# EAGLE design oshcamp23-badge-RevA2 (EAGLE 9.6.2)

## Sheet 1 of 2
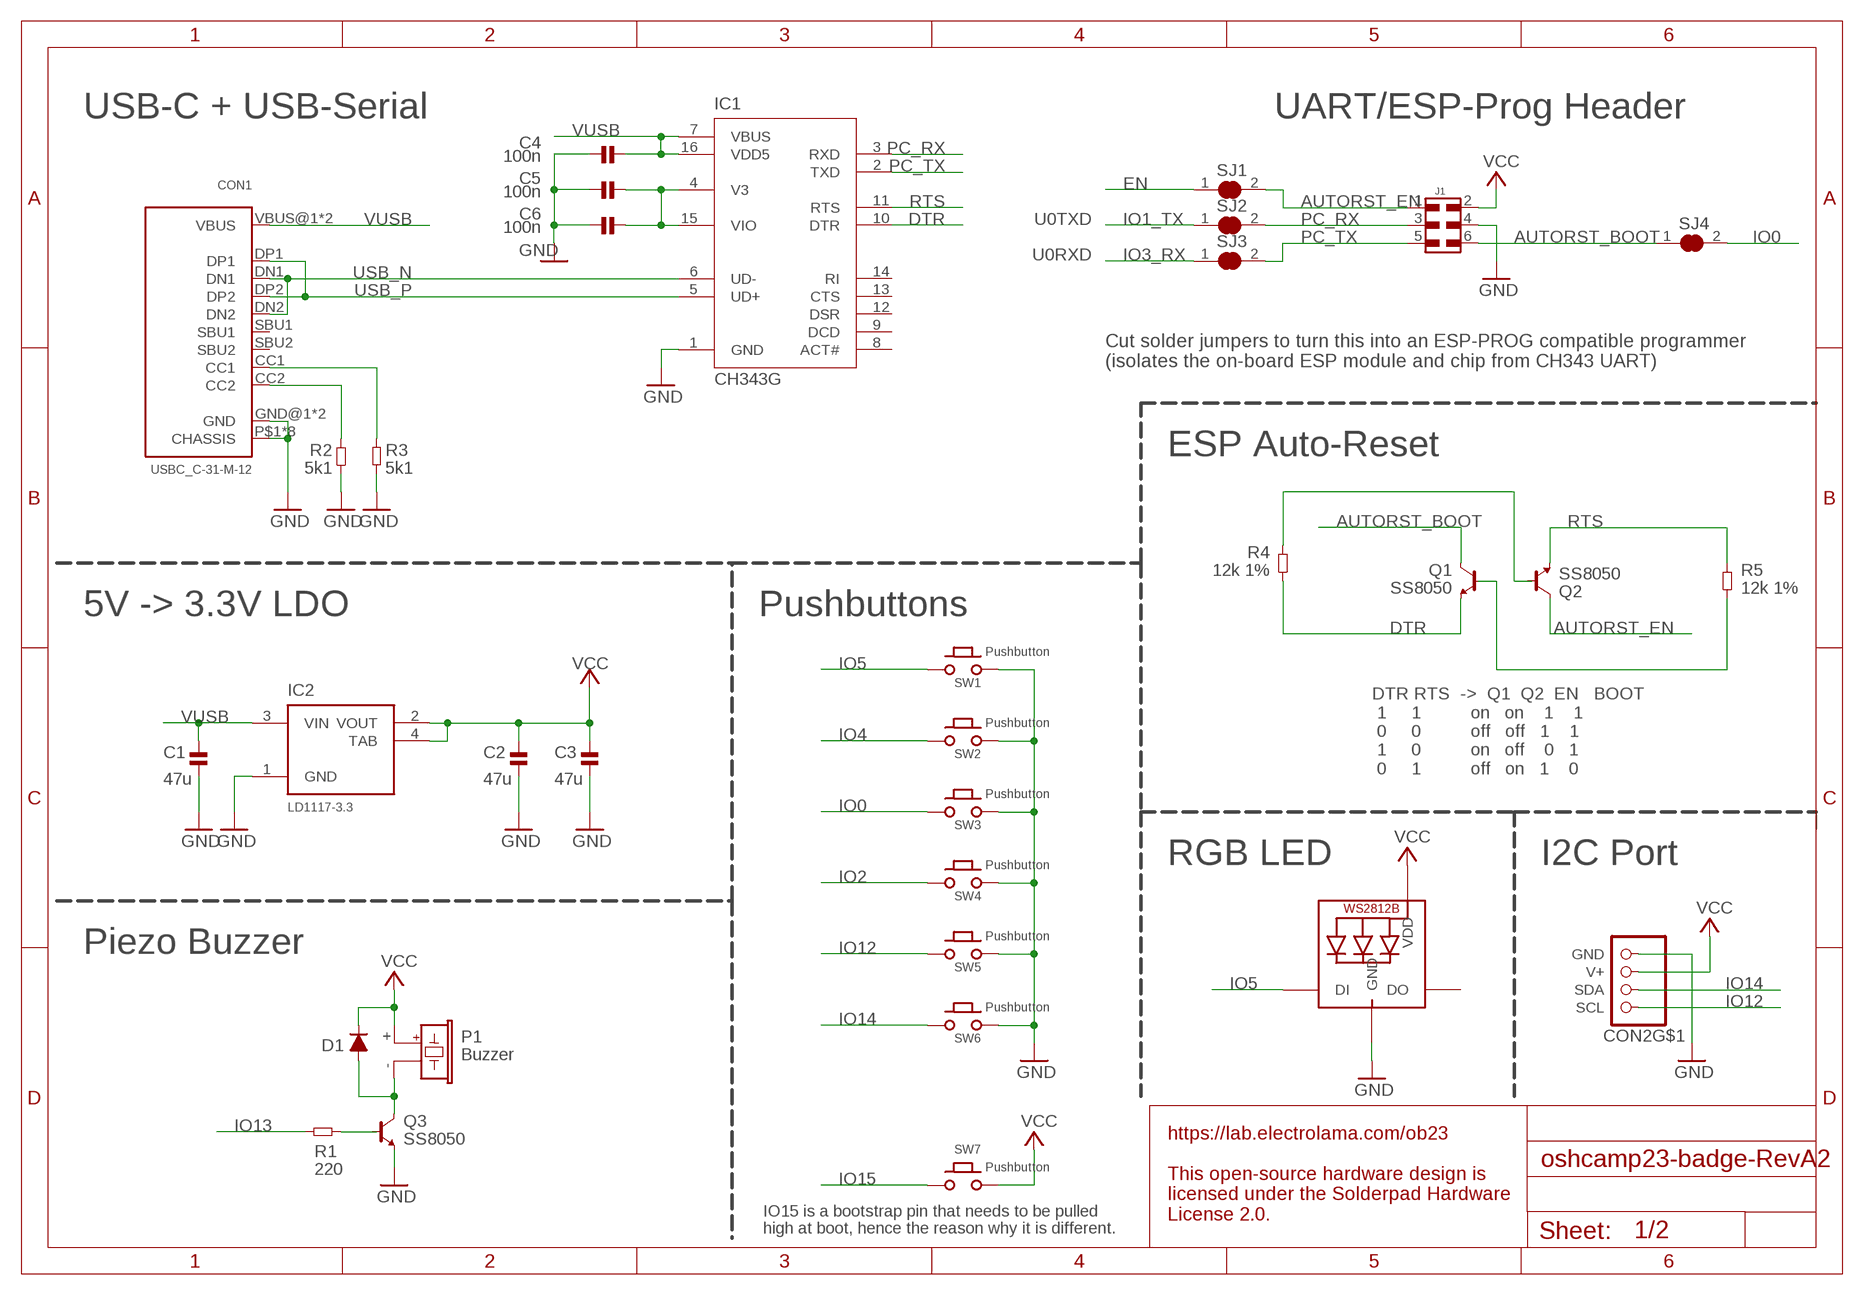
[diagram p0: schematic, sheet 1]

### Parts
C1  47u  CAP-1206  [_PKG_C_1206]
C2  47u  CAP-1206  [_PKG_C_1206]
C3  47u  CAP-1206  [_PKG_C_1206]
C4  100n  CAP-0402  [_PKG_C_0402]
C5  100n  CAP-0402  [_PKG_C_0402]
C6  100n  CAP-0402  [_PKG_C_0402]
CON1  USBC_C-31-M-12  USBC_USB-C-12  [USBC_C-31-M-12]
CON2  STEMMA_I2C_QT  [JST_SH4]
D1  DIODE-SWITCHING-1N4148W  [_PKG_SOD123]
IC1  CH343G  INTERFACE-CH343G  [_PKG_SOP16]
IC2  LD1117-3.3  POWER-LDO-LD1117-SOT223-4  [_PKG_SOT223-4_TI-DCY4]
J1  61030621121  6103XX21121_61030621121  [61030621121]
LED1  WS2812B5050  [WS2812B]
P1  Buzzer  PIEZO-MLT-8530  [MLT-8530]
Q1  SS8050  NPN-MMBT5550LT1G  [SOT96P237X111-3N]
Q2  SS8050  NPN-MMBT5550LT1G  [SOT96P237X111-3N]
Q3  SS8050  NPN-MMBT5550LT1G  [SOT96P237X111-3N]
R1  220  RES-0603  [_PKG_R_0603]
R2  5k1  RES-0603  [_PKG_R_0603]
R3  5k1  RES-0603  [_PKG_R_0603]
R4  12k 1%  RES-0402  [_PKG_R_0402]
R5  12k 1%  RES-0402  [_PKG_R_0402]
SJ1  SJ-SHORT  [SJ-SHORT]
SJ2  SJ-SHORT  [SJ-SHORT]
SJ3  SJ-SHORT  [SJ-SHORT]
SJ4  SJ-SHORT  [SJ-SHORT]
SW1  Pushbutton  PUSHBUTTON-6X6MM  [GENERIC_SPNO_4P_6X6MM]
SW2  Pushbutton  PUSHBUTTON-6X6MM  [GENERIC_SPNO_4P_6X6MM]
SW3  Pushbutton  PUSHBUTTON-6X6MM  [GENERIC_SPNO_4P_6X6MM]
SW4  Pushbutton  PUSHBUTTON-6X6MM  [GENERIC_SPNO_4P_6X6MM]
SW5  Pushbutton  PUSHBUTTON-6X6MM  [GENERIC_SPNO_4P_6X6MM]
SW6  Pushbutton  PUSHBUTTON-6X6MM  [GENERIC_SPNO_4P_6X6MM]
SW7  Pushbutton  PUSHBUTTON-6X6MM  [GENERIC_SPNO_4P_6X6MM]

### Nets
AUTORST_BOOT: J1.6 Q1.3(C) SJ4.1
AUTORST_EN: J1.1 Q2.3(C) SJ1.2
CH343_3V: C5.1 C6.1 IC1.4(V3) IC1.15(VIO)
DTR: IC1.10(DTR) Q1.2(E) R4.1
EN: SJ1.1 ; also sheet 2
GND: C1.2 C2.2 C3.2 C4.2 C5.2 C6.2 CON1.GND@1(GND) CON1.GND@2(GND) CON1.P$1(CHASSIS) CON1.P$2(CHASSIS) CON1.P$3(CHASSIS) CON1.P$4(CHASSIS) CON1.P$5(CHASSIS) CON1.P$6(CHASSIS) CON1.P$7(CHASSIS) CON1.P$8(CHASSIS) CON2.1(GND) IC1.1(GND) IC2.1(GND) J1.4 LED1.3-GND(GND) Q3.2(E) R2.1 R3.1 SW1.P$3 SW1.P$4 SW2.P$3 SW2.P$4 SW3.P$3 SW3.P$4 SW4.P$3 SW4.P$4 SW5.P$3 SW5.P$4 SW6.P$3 SW6.P$4 ; also sheet 2
IO0: SJ4.2 SW3.P$1 SW3.P$2 ; also sheet 2
IO1_TX: SJ2.1 ; also sheet 2
IO2: SW4.P$1 SW4.P$2 ; also sheet 2
IO3_RX: SJ3.1 ; also sheet 2
IO4: SW2.P$1 SW2.P$2 ; also sheet 2
IO5: LED1.4-DIN(DI) SW1.P$1 SW1.P$2 ; also sheet 2
IO12: CON2.4(SCL) SW5.P$1 SW5.P$2 ; also sheet 2
IO13: R1.2 ; also sheet 2
IO14: CON2.3(SDA) SW6.P$1 SW6.P$2 ; also sheet 2
IO15: SW7.P$1 SW7.P$2 ; also sheet 2
N$5: Q1.1(B) R5.1
N$12: D1.2(A) P1.- Q3.3(C)
N$13: Q2.1(B) R4.2
N$16: CON1.CC1 R3.2
N$17: CON1.CC2 R2.2
N$23: Q3.1(B) R1.1
PC_RX: IC1.3(RXD) J1.3 SJ2.2
PC_TX: IC1.2(TXD) J1.5 SJ3.2
RTS: IC1.11(RTS) Q2.2(E) R5.2
USB_N: CON1.DN1 CON1.DN2 IC1.6(UD-)
USB_P: CON1.DP1 CON1.DP2 IC1.5(UD+)
VCC: C2.1 C3.1 CON2.2(V+) D1.1(C) IC2.2(VOUT) IC2.4(TAB) J1.2 LED1.1-VDD(VDD) P1.+ SW7.P$3 SW7.P$4 ; also sheet 2
VUSB: C1.1 C4.1 CON1.VBUS@1(VBUS) CON1.VBUS@2(VBUS) IC1.7(VBUS) IC1.16(VDD5) IC2.3(VIN)
Unconnected: CON1.SBU1 CON1.SBU2 CON2.MT1(MT) CON2.MT2(MT) IC1.8(ACT#) IC1.9(DCD) IC1.12(DSR) IC1.13(CTS) IC1.14(RI) LED1.2-DOUT(DO)

### Notes on the sheet
- USB-C + USB-Serial | UART/ESP-Prog Header
- U0TXD
- U0RXD
- Cut solder jumpers to turn this into an ESP-PROG compatible programmer
  (isolates the on-board ESP module and chip from CH343 UART)
- ESP Auto-Reset
- 5V -> 3.3V LDO | Pushbuttons
- DTR RTS  ->  Q1  Q2  EN   BOOT
   1     1          on   on    1    1
   0     0          off   off   1    1
   1     0          on   off    0   1
   0     1          off   on   1    0
- RGB LED | I2C Port
- Piezo Buzzer
- https://lab.electrolama.com/ob23
  
  This open-source hardware design is 
  licensed under the Solderpad Hardware 
  License 2.0.
- IO15 is a bootstrap pin that needs to be pulled
  high at boot, hence the reason why it is different.

## Sheet 2 of 2
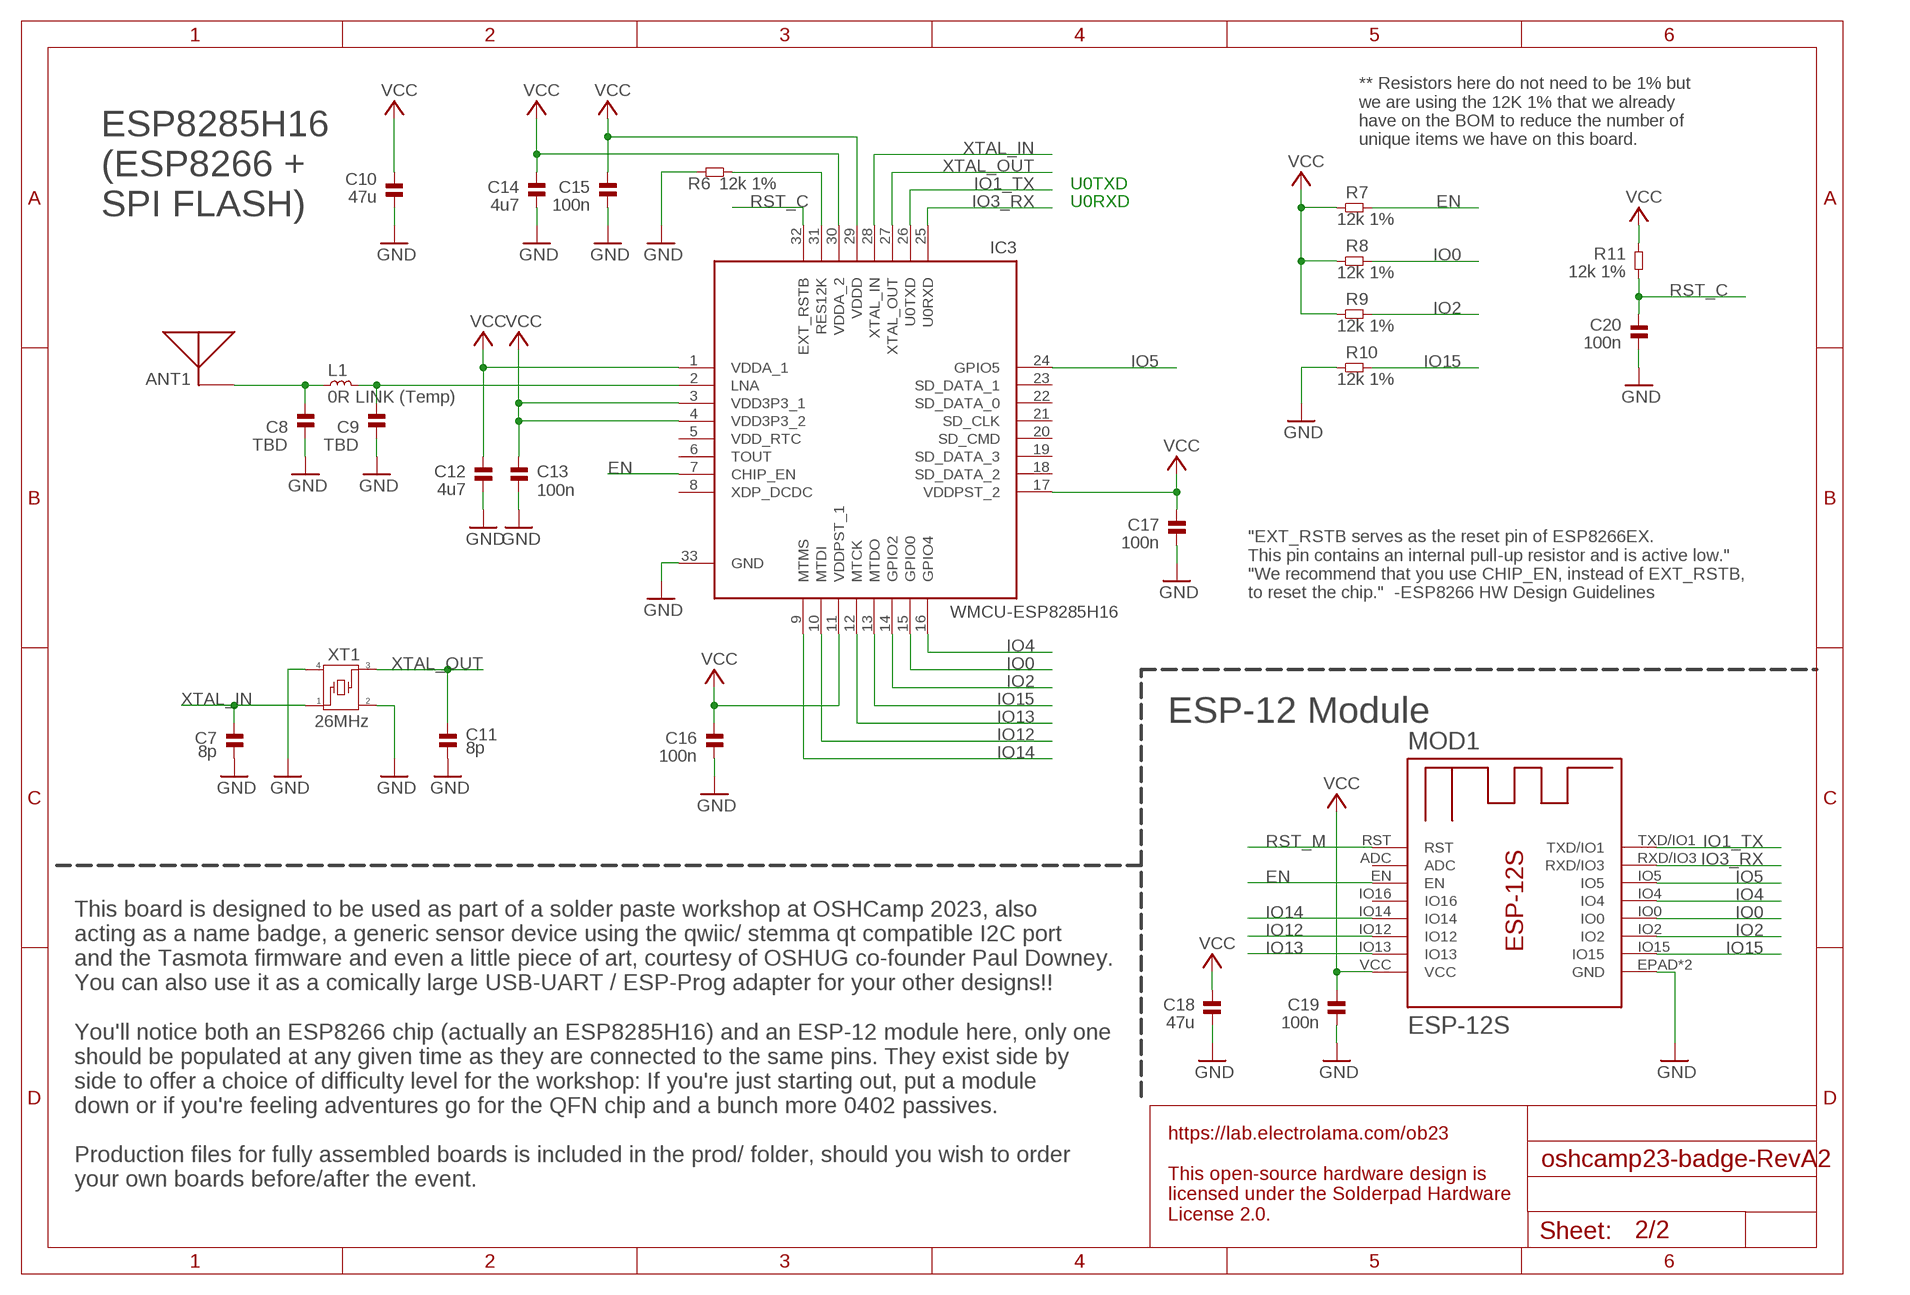
[diagram p1: schematic, sheet 2]

### Parts
ANT1  ANT3216LL00R2400A  ANT-CERAMIC-YAGEO-ANT3216LL00R2400A  [YAGEO-ANT3216LL00R2400A]
C7  8p  CAP-0402  [_PKG_C_0402]
C8  TBD  CAP-0402-NOTHERMALS  [_PKG_C_0402_NOTHERMALS]
C9  TBD  CAP-0402-NOTHERMALS  [_PKG_C_0402_NOTHERMALS]
C10  47u  CAP-1206  [_PKG_C_1206]
C11  8p  CAP-0402  [_PKG_C_0402]
C12  4u7  CAP-0402-NOTHERMALS  [_PKG_C_0402_NOTHERMALS]
C13  100n  CAP-0402-NOTHERMALS  [_PKG_C_0402_NOTHERMALS]
C14  4u7  CAP-0402-NOTHERMALS  [_PKG_C_0402_NOTHERMALS]
C15  100n  CAP-0402-NOTHERMALS  [_PKG_C_0402_NOTHERMALS]
C16  100n  CAP-0402-NOTHERMALS  [_PKG_C_0402_NOTHERMALS]
C17  100n  CAP-0402-NOTHERMALS  [_PKG_C_0402_NOTHERMALS]
C18  47u  CAP-1206  [_PKG_C_1206]
C19  100n  CAP-0402  [_PKG_C_0402]
C20  100n  CAP-0402-NOTHERMALS  [_PKG_C_0402_NOTHERMALS]
IC3  WMCU-ESP8285H16  [QFN50P500X500X90-33N]
L1  0R LINK (Temp)  INDUCTOR-0402  [_PKG_L_0402]
MOD1  ESP-12S  MODULE_ESP-12S  [ESP-12S]
R6  12k 1%  RES-0402  [_PKG_R_0402]
R7  12k 1%  RES-0402  [_PKG_R_0402]
R8  12k 1%  RES-0402  [_PKG_R_0402]
R9  12k 1%  RES-0402  [_PKG_R_0402]
R10  12k 1%  RES-0402  [_PKG_R_0402]
R11  12k 1%  RES-0402  [_PKG_R_0402]
XT1  26MHz  XTAL-4P-2016  [XTAL-4P-2016]

### Nets
ANT: C9.2 IC3.2(LNA) L1.2
ANT': ANT1.S1(FEED) C8.2 L1.1
EN: IC3.7(CHIP_EN) MOD1.EN R7.2 ; also sheet 1
GND: C7.1 C8.1 C9.1 C10.2 C11.1 C12.1 C13.1 C14.1 C15.1 C16.1 C17.1 C18.2 C19.2 C20.1 IC3.33(GND) MOD1.EPAD(GND) MOD1.GND R6.2 R10.1 XT1.2 XT1.4 ; also sheet 1
IO0: IC3.15(GPIO0) MOD1.IO0 R8.2 ; also sheet 1
IO1_TX: IC3.26(U0TXD) MOD1.TXD/IO1 ; also sheet 1
IO2: IC3.14(GPIO2) MOD1.IO2 R9.2 ; also sheet 1
IO3_RX: IC3.25(U0RXD) MOD1.RXD/IO3 ; also sheet 1
IO4: IC3.16(GPIO4) MOD1.IO4 ; also sheet 1
IO5: IC3.24(GPIO5) MOD1.IO5 ; also sheet 1
IO12: IC3.10(MTDI) MOD1.IO12 ; also sheet 1
IO13: IC3.12(MTCK) MOD1.IO13 ; also sheet 1
IO14: IC3.9(MTMS) MOD1.IO14 ; also sheet 1
IO15: IC3.13(MTDO) MOD1.IO15 R10.2 ; also sheet 1
N$6: IC3.31(RES12K) R6.1
RST_C: C20.2 IC3.32(EXT_RSTB) R11.1
RST_M: MOD1.RST
VCC: C10.1 C12.2 C13.2 C14.2 C15.2 C16.2 C17.2 C18.1 C19.1 IC3.1(VDDA_1) IC3.3(VDD3P3_1) IC3.4(VDD3P3_2) IC3.11(VDDPST_1) IC3.17(VDDPST_2) IC3.29(VDDD) IC3.30(VDDA_2) MOD1.VCC R7.1 R8.1 R9.1 R11.2 ; also sheet 1
XTAL_IN: C7.2 IC3.28(XTAL_IN) XT1.1
XTAL_OUT: C11.2 IC3.27(XTAL_OUT) XT1.3
Unconnected: IC3.5(VDD_RTC) IC3.6(TOUT) IC3.8(XDP_DCDC) IC3.18(SD_DATA_2) IC3.19(SD_DATA_3) IC3.20(SD_CMD) IC3.21(SD_CLK) IC3.22(SD_DATA_0) IC3.23(SD_DATA_1) MOD1.ADC MOD1.IO16

### Notes on the sheet
- ESP8285H16
  (ESP8266 +
  SPI FLASH)
- ** Resistors here do not need to be 1% but
  we are using the 12K 1% that we already
  have on the BOM to reduce the number of
  unique items we have on this board.
- U0TXD
- U0RXD
- ANT1
- "EXT_RSTB serves as the reset pin of ESP8266EX. 
  This pin contains an internal pull-up resistor and is active low."
  "We recommend that you use CHIP_EN, instead of EXT_RSTB, 
  to reset the chip."  -ESP8266 HW Design Guidelines
- ESP-12 Module
- This board is designed to be used as part of a solder paste workshop at OSHCamp 2023, also
  acting as a name badge, a generic sensor device using the qwiic/ stemma qt compatible I2C port 
  and the Tasmota firmware and even a little piece of art, courtesy of OSHUG co-founder Paul Downey. 
  You can also use it as a comically large USB-UART / ESP-Prog adapter for your other designs!!
  
  You'll notice both an ESP8266 chip (actually an ESP8285H16) and an ESP-12 module here, only one 
  should be populated at any given time as they are connected to the same pins. They exist side by 
  side to offer a choice of difficulty level for the workshop: If you're just starting out, put a module 
  down or if you're feeling adventures go for the QFN chip and a bunch more 0402 passives.
  
  Production files for fully assembled boards is included in the prod/ folder, should you wish to order 
  your own boards before/after the event.
- https://lab.electrolama.com/ob23
  
  This open-source hardware design is 
  licensed under the Solderpad Hardware 
  License 2.0.

## Library data of the parts
ANT1 = ok-rf-dev:ANT-CERAMIC-YAGEO-ANT3216LL00R2400A; JLCASSY: C293767; KIT_EASY: NO
C1-C3 = ok-discretes-dev:CAP; JLCASSY: C96123; MPN: CL31A476MPHNNNE
C4-C6 = ok-discretes-dev:CAP; JLCASSY: C307331
C7 C11 = ok-discretes-dev:CAP; JLCASSY: C1578; KIT_EASY: NO
C8 C9 = ok-discretes-dev:CAP; KIT_EASY: NO; KIT_HARD: NO
C10 = ok-discretes-dev:CAP; JLCASSY: C96123; KIT_EASY: NO; MPN: CL31A476MPHNNNE
C12 C14 = ok-discretes-dev:CAP; JLCASSY: C23733; KIT_EASY: NO
C13 C15-C17 C20 = ok-discretes-dev:CAP; JLCASSY: C307331; KIT_EASY: NO
C18 = ok-discretes-dev:CAP; JLCASSY: C96123; KIT_HARD: NO; MPN: CL31A476MPHNNNE
C19 = ok-discretes-dev:CAP; JLCASSY: C307331; KIT_HARD: NO
CON1 = ok-connectors-dev:USBC_USB-C-12; JLCASSY: C165948
CON2 = microbuilder:STEMMA_I2C; JLCASSY: C145956
D1 = ok-discretes-dev:DIODE-SWITCHING-1N4148W; JLCASSY: C81598; KIT_EASY: NO; KIT_HARD: NO
IC1 = ok-chips-dev:INTERFACE-CH343G; JLCASSY: C2844153
IC2 = ok-chips-dev:POWER-LDO-LD1117; JLCASSY: C6186
IC3 = ok-chips-dev:WMCU-ESP8285H16: IC RF TXRX+MCU WIFI 32VFQFN Source: Datasheet <https://componentsearchengine.com/Datasheets/1/ESP8285H16.pdf>; DESCRIPTION: IC RF TXRX+MCU WIFI 32VFQFN; HEIGHT: 0.9mm; JLCASSY: C967019; KIT_EASY: NO; MANUFACTURER_NAME: Espressif Systems; MANUFACTURER_PART_NUMBER: ESP8285H16; MOUSER_PART_NUMBER: 356-ESP8285H16; MOUSER_PRICE-STOCK: https://www.mouser.co.uk/ProductDetail/Espressif-Systems/ESP8285H16?qs=Cb2nCFKsA8p%2FOZGxIdZOag%3D%3D
J1 = Wurth_Connectors_WR-PHD:6103XX21121_61030621121: WR-PHD 2.54 mm SMT Dual Pin Header ARTICLE PROPERTIES: Pins:4;​ 6;​ 8;​ 10;​ 12;​ 14;​ 16;​ 20 KIND PROPERTIES: Pitch：2.54 mm Quality Class:3 as per CECC 75 301-802 Rows：Dual Gender：Pin Header Type：Straight MATERIAL PROPERTIES: Insulator Material :PA6T Insulator Flammability Rating:UL94 V-0 Contact Material:Copper Alloy Contact Plating:Gold Contact Type:Stamped GENERAL INFORMATION Operating Temperature:-40 up to +125 °C ELECTRICAL PROPERTIES: Rated Current:max. IR 1:3 A Withstanding Voltage:500 V (AC) Contact Resistance:20 mΩ RISO:1000 MΩ CERTIFICATION UL Approval:E323964 PACKAGING PROPERTIES Packaging:Tape and Reel with Cap <https://www.we-online.com/catalog/media/o33205v209%20Family_WR-PHD_610xxx21121.jpg> Details see: https://www.we-online.com/catalog/en/PHD_2_54_SMT_DUAL_PIN_HEADER_6100XX21121 Updated by Ella Wu 2021-11-04 2021 (C) Würth Elektronik; DATASHEET-URL: https://www.we-online.com/redexpert/spec/61030621121?ae; GENDER: Pin Header; IR: 3A; JLCASSY: C780054; MOUNT: THT; PACKAGING: Tape and Reel with Cap; PART-NUMBER: 61030621121; PINS: 6; PITCH: 2.54mm; ROWS: Dual; TYPE: Straight
L1 = ok-discretes-dev:INDUCTOR; KIT_EASY: NO
LED1 = adafruit:WS2812B
MOD1 = ok-modules-dev:MODULE_ESP-12S; JLCASSY: C82898; KIT_HARD: NO
P1 = ok-electromech-dev:PIEZO-MLT-8530; JLCASSY: C94599
Q1-Q3 = ok-discretes-dev:NPN-MMBT5550LT1G: Source: Datasheet <http://www.onsemi.com/pub/Collateral/MMBT5550LT1-D.PDF>; ARROW_PART_NUMBER: MMBT5550LT1G; ARROW_PRICE-STOCK: https://www.arrow.com/en/products/mmbt5550lt1g/on-semiconductor?region=nac; HEIGHT: 1.11mm; JLCASSY: C2150; MANUFACTURER_NAME: ON Semiconductor; MANUFACTURER_PART_NUMBER: MMBT5550LT1G; MOUSER_PART_NUMBER: 863-MMBT5550LT1G; MOUSER_PRICE-STOCK: https://www.mouser.co.uk/ProductDetail/onsemi/MMBT5550LT1G?qs=R2UZ7gjkEjKW3fmkaqXxTw%3D%3D
R1 = ok-discretes-dev:RES; JLCASSY: C22962
R2 R3 = ok-discretes-dev:RES; JLCASSY: C23186
R4 R5 = ok-discretes-dev:RES; JLCASSY: C25752
R6-R11 = ok-discretes-dev:RES; JLCASSY: C25752; KIT_EASY: NO
SJ1-SJ4 = ok-mechanical-dev:SJ-SHORT; KIT_EASY: NO; KIT_HARD: NO
SW1-SW7 = ok-electromech-dev:PUSHBUTTON-6X6MM; JLCASSY: C620316
XT1 = ok-xtal-osc-dev:XTAL-4P-2016; JLCASSY: C2762193; KIT_EASY: NO

## Board
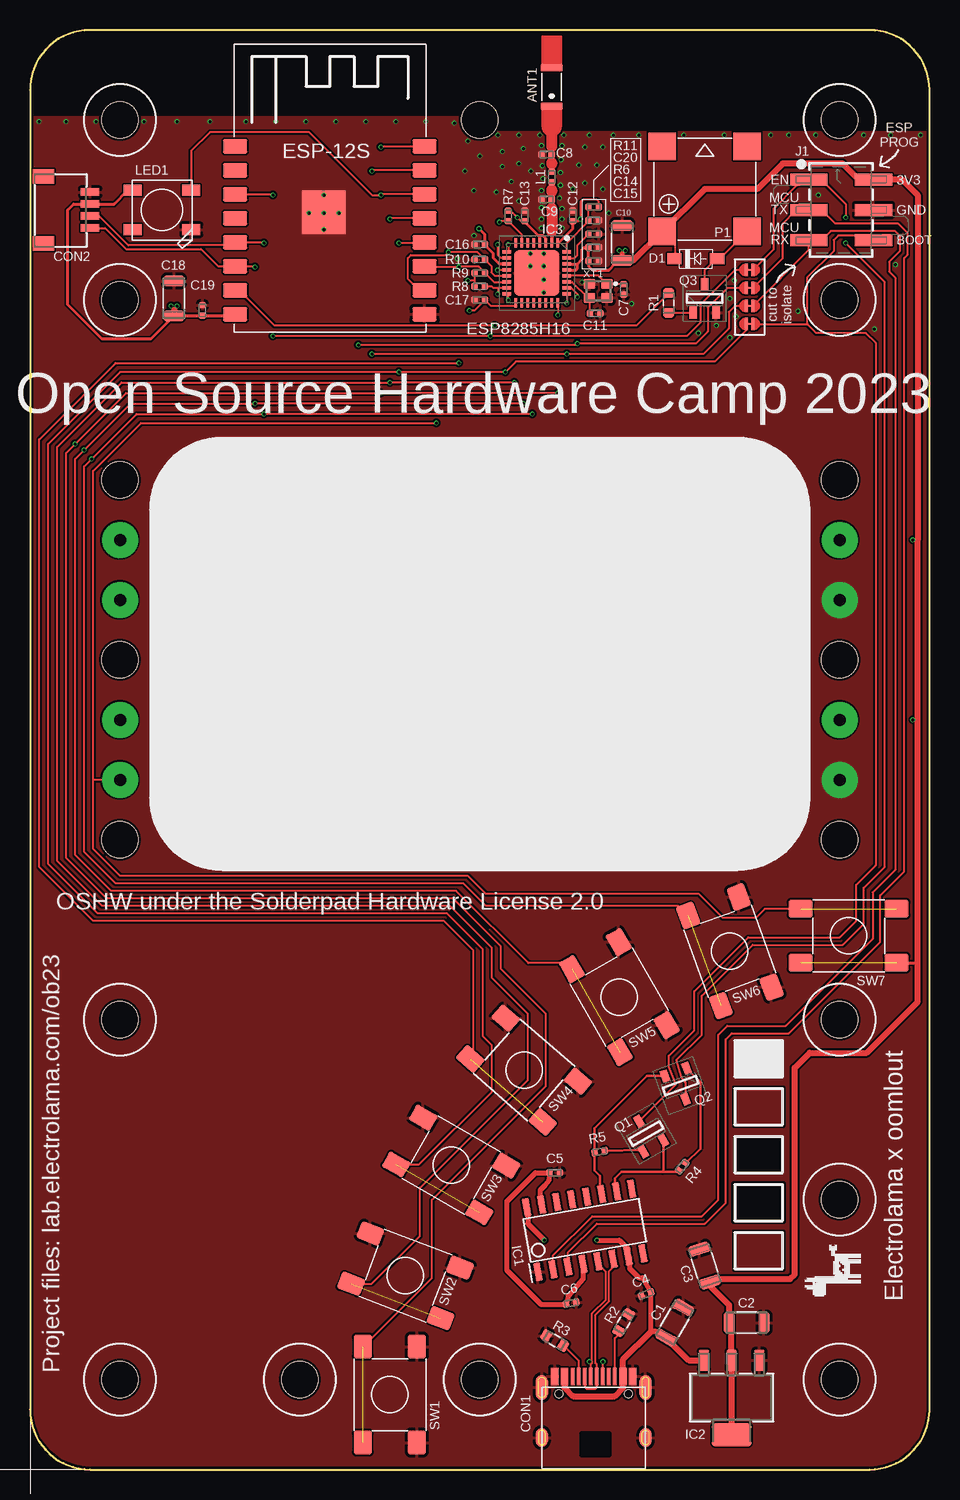
[diagram p2: board, top side]
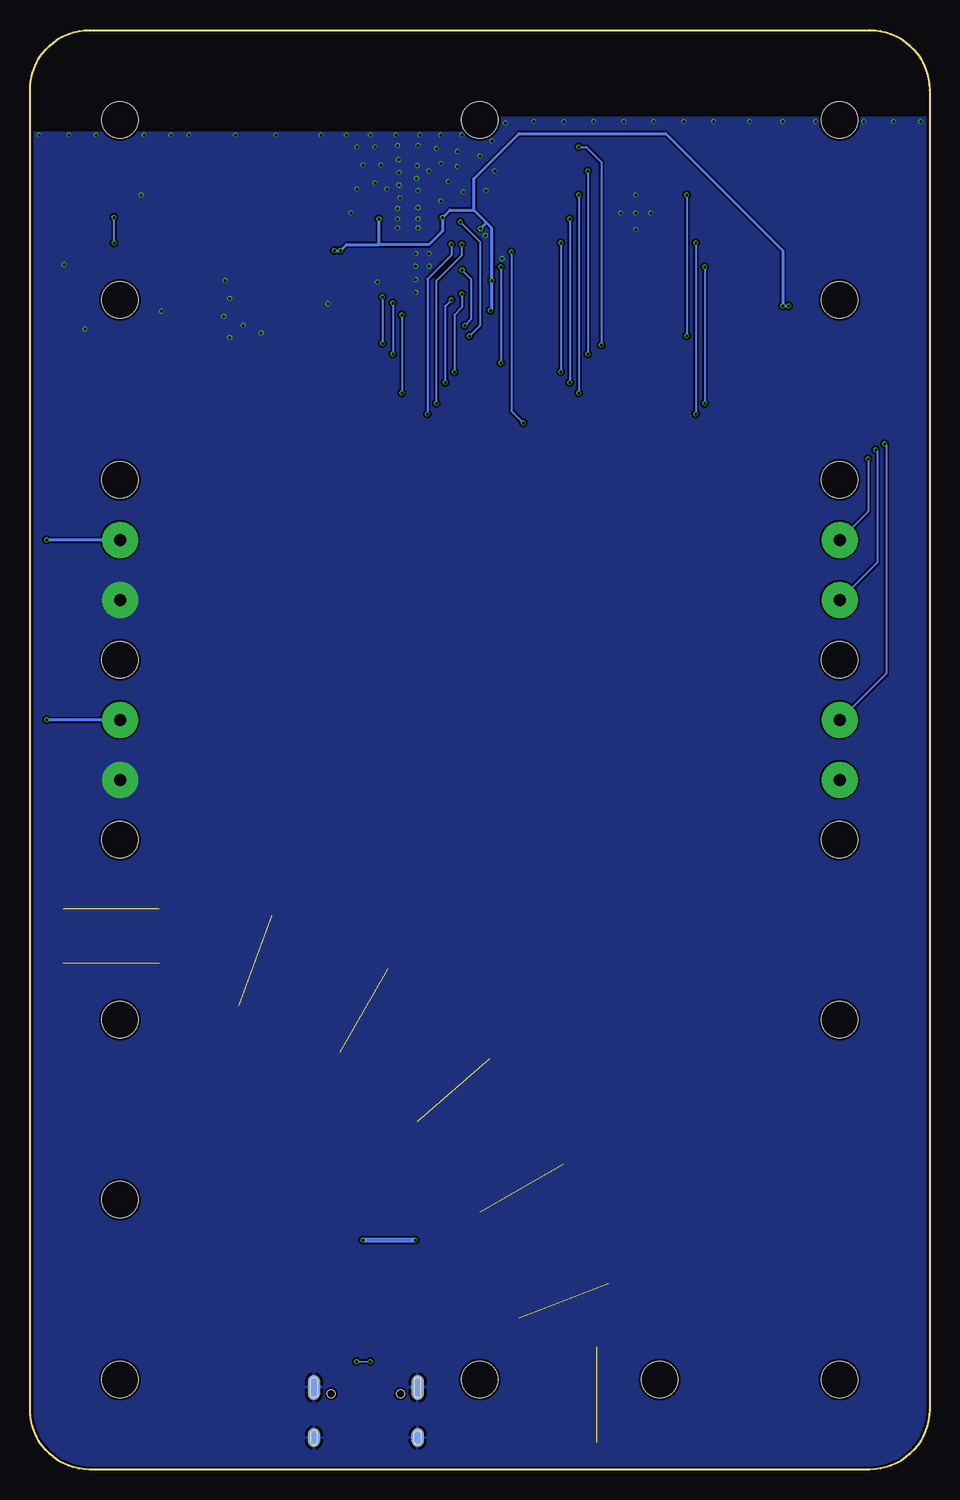
[diagram p3: board, bottom side, seen from below]

Size 75 x 120 mm. Coordinates in mm from the lower left corner, seen from the top.
Outline: 70,120 5,120 arc90 0,115 0,5 arc90 5,0 70,0 arc90 75,5 75,115 arc90 70,120
Copper layers (1*16): Top 0.035mm / dielectric 1.6mm / Bottom 0.035mm
Design rules "jlcpcb-2layers *": minimum track width 5mil, minimum drill 0.3mm, track to track 5mil, track to pad 5mil, pad to pad 5mil, via to via 5mil, smd to smd 5mil, copper to edge 0.2mm, drill to drill 6mil, minimum pad ring 10mil, minimum via ring 3mil, stop-mask expansion 4mil, vias tented up to drill 100mil, thermal gap 10mil
Holes 3.05 mm at 7.5,7.5 22.5,7.5 37.5,7.5 67.5,7.5 67.5,22.5 67.5,37.5 67.5,97.5 67.5,112.5 7.5,112.5 7.5,97.5 7.5,37.5 67.5,82.5 67.5,67.5 67.5,52.5 7.5,82.5 7.5,67.5 7.5,52.5 37.5,112.5
tRestrict: area 58.7,20.7 to 62.8,23.8; area 58.9,24.9 to 62.6,27.6; area 46,1.2 to 48.2,3

### Footprints (pad centres in the part's own frame; a part is rotated, then mirrored left to right if it is on the bottom)
YAGEO-ANT3216LL00R2400A = smd 1.8 x 0.6: S1 0,2.15; S2 0,5.35
_PKG_C_1206 = smd 0.9 x 1.7: 1 -1.45,0; 2 1.45,0
_PKG_C_0402 = smd 0.54 x 0.6: 1 -0.43,0; 2 0.43,0
_PKG_C_0402_NOTHERMALS = smd 0.54 x 0.6: 1 -0.43,0; 2 0.43,0
USBC_C-31-M-12 = smd 0.3 x 1.45: CC1 -1.25,3.005; CC2 1.75,3.005; DN1 0.25,3.005; DN2 -0.75,3.005; DP1 -0.25,3.005; DP2 0.75,3.005; SBU1 1.25,3.005; SBU2 -1.75,3.005 | smd 0.6 x 1.45: GND@1 -3.25,3.005; GND@2 3.25,3.005; VBUS@1 -2.45,3.005; VBUS@2 2.45,3.005 | smd 1 x 2.1: P$1 4.32,2.09; P$2 -4.32,2.09 | smd 1 x 1.6: P$3 -4.32,-2.09; P$4 4.32,-2.09 | smd 1 x 2.1 bottom: P$5 -4.32,2.09; P$8 4.32,2.09 | smd 1 x 1.6 bottom: P$6 -4.32,-2.09; P$7 4.32,-2.09 | hole 0.65: 2.89,1.56; -2.89,1.56
JST_SH4 = smd 0.6 x 1.55: 1 -1.5,2.514; 2 -0.5,2.514; 3 0.5,2.514; 4 1.5,2.514 | smd 1.2 x 1.8: MT1 -2.8,-1.386; MT2 2.8,-1.386
_PKG_SOD123 = smd 1.2 x 0.9: 1 -1.775,0; 2 1.775,0
_PKG_SOP16 = smd 0.61 x 1.524: 1 -4.445,-2.794; 2 -3.175,-2.794; 3 -1.905,-2.794; 4 -0.635,-2.794; 5 0.635,-2.794; 6 1.905,-2.794; 7 3.175,-2.794; 8 4.445,-2.794; 9 4.445,2.667; 10 3.175,2.667; 11 1.905,2.667; 12 0.635,2.667; 13 -0.635,2.667; 14 -1.905,2.667; 15 -3.175,2.667; 16 -4.445,2.667
_PKG_SOT223-4_TI-DCY4 = smd 0.889 x 1.765: 1 -2.311,-3.118; 2 0,-3.118; 3 2.311,-3.118 | smd 3.302 x 1.905: 4 0,3.124
QFN50P500X500X90-33N = smd 0.8 x 0.3: 1 -2.5,1.75; 2 -2.5,1.25; 3 -2.5,0.75; 4 -2.5,0.25; 5 -2.5,-0.25; 6 -2.5,-0.75; 7 -2.5,-1.25; 8 -2.5,-1.75; 17 2.5,-1.75; 18 2.5,-1.25; 19 2.5,-0.75; 20 2.5,-0.25; 21 2.5,0.25; 22 2.5,0.75; 23 2.5,1.25; 24 2.5,1.75 | smd 0.3 x 0.8: 9 -1.75,-2.5; 10 -1.25,-2.5; 11 -0.75,-2.5; 12 -0.25,-2.5; 13 0.25,-2.5; 14 0.75,-2.5; 15 1.25,-2.5; 16 1.75,-2.5; 25 1.75,2.5; 26 1.25,2.5; 27 0.75,2.5; 28 0.25,2.5; 29 -0.25,2.5; 30 -0.75,2.5; 31 -1.25,2.5; 32 -1.75,2.5 | smd 3.75 x 3.75: 33 0,0
61030621121 = smd 1 x 3.1: 1 -2.54,-2.7; 2 -2.54,2.7; 3 0,-2.7; 4 0,2.7; 5 2.54,-2.7; 6 2.54,2.7
_PKG_L_0402 = smd 0.54 x 0.6: 1 -0.43,0; 2 0.43,0
WS2812B = smd 1.5 x 0.9: 1-VDD 2.45,-1.65; 2-DOUT 2.45,1.65; 3-GND -2.45,1.65; 4-DIN -2.45,-1.65
ESP-12S = smd 2 x 1.2: ADC -7.9,1.5; EN -7.9,-0.5; GND 7.9,-10.5; IO0 7.9,-4.5; IO2 7.9,-6.5; IO4 7.9,-2.5; IO5 7.9,-0.5; IO12 -7.9,-6.5; IO13 -7.9,-8.5; IO14 -7.9,-4.5; IO15 7.9,-8.5; IO16 -7.9,-2.5; RST -7.9,3.5; RXD/IO3 7.9,1.5; TXD/IO1 7.9,3.5; VCC -7.9,-10.5 | smd 3.6 x 3.6: EPAD -0.5,-2
MLT-8530 = smd 2.3 x 2.3: + -3.55,3.55; - -3.55,-3.55; DUMMY1 3.55,3.55; DUMMY2 3.55,-3.55
SOT96P237X111-3N = smd 1 x 0.6: 1 -1.2,0.955; 2 -1.2,-0.955; 3 1.2,0
_PKG_R_0603 = smd 0.79 x 0.93: 1 -0.82,0; 2 0.82,0
_PKG_R_0402 = smd 0.54 x 0.6: 1 -0.43,0; 2 0.43,0
SJ-SHORT = smd 0.254 x 1.016: 1 -0.254,0; 2 0.254,0 | smd 0.508 x 0.152: S 0,0
GENERIC_SPNO_4P_6X6MM = smd 2 x 1.5: P$1 -4,2.25; P$2 4,2.25; P$3 -4,-2.25; P$4 4,-2.25
XTAL-4P-2016 = smd 0.95 x 0.85: 1 -0.725,-0.575; 2 0.725,-0.575; 3 0.725,0.575; 4 -0.725,0.575

### Placement (x,y rotation side)
ANT1  43.5,111.5 0 top
C1  53.75,12.25 60 top
C2  59.75,12.25 0 top
C3  56.25,17 108 top
C4  51.38,14.62 200 top
C5  43.75,24.75 0 top
C6  45.12,13.88 10 top
C7  49.5,98.38 90 top
C8  43.07,109.62 0 top
C9  43.07,105.88 0 top
C10  49.38,102.25 90 top
C11  47.12,96.38 180 top
C12  45.25,104.5 270 top
C13  41.25,104.5 270 top
C14  47,101.88 180 top
C15  47,100.75 180 top
C16  37.5,102.12 0 top
C17  37.5,97.5 0 top
C18  12,97.62 90 top
C19  14.38,96.62 90 top
C20  47,104.12 180 top
CON1  47,4.75 0 top
CON2  2.5,105 270 top
D1  55.5,100.94 0 top
IC1  46.25,20 10 top
IC2  58.5,6 180 top
IC3  42.25,99.75 270 top
J1  67.62,105 270 top
L1  43.5,107.75 270 top
LED1  11,105 180 top
MOD1  25,106.8 0 top
P1  56.25,106.75 90 top
Q1  51.38,28 120 top
Q2  54.25,32 290 top
Q3  56.25,97.62 90 top
R1  53.25,97.25 90 top
R2  49.5,12.25 240 top
R3  43.75,10.75 330 top
R4  54.38,25.25 50 top
R5  47.5,26.5 190 top
R6  47,103 0 top
R7  39.88,104.5 270 top
R8  37.5,98.62 0 top
R9  37.5,99.75 0 top
R10  37.5,100.88 0 top
R11  47,105.25 0 top
SJ1  60,100 0 top
SJ2  60,98.5 0 top
SJ3  60,97 0 top
SJ4  60,95.5 180 top
SW1  30,6.25 90 top
SW2  31.3,16.15 159 top
SW3  35.12,25.38 150 top
SW4  41.2,33.3 139 top
SW5  49.13,39.38 120 top
SW6  58.35,43.2 110 top
SW7  68.25,44.5 0 top
XT1  47.38,98.25 180 top

### Tracks (layer width: path | path; a pad name or v marks a point on that pad's centre or on a via)
ANT
  Top 0.305: IC3.2 43.5,103.19
  Top 0.406: 43.5,105.12 C9.2 43.5,106.55 | L1.2 43.5,106.65
  Top 0.92: 43.5,105.12 43.5,103.19 | 43.5,106.65 43.5,106.55
ANT'
  Top 0.406: 43.5,110.31 C8.2 43.5,108.93 | 43.5,108.84 L1.1
  Top 0.508: ANT1.S1 43.5,111.75
  Top 0.92: 43.5,110.31 43.5,111.75 | 43.5,108.93 43.5,108.84
AUTORST_BOOT
  Top 0.152: Q1.3 53.84,32.11 53.25,33.57 53.25,34.5 55.38,36.62 55.38,39.88 59.88,44.38 67.5,44.38 68.88,45.75 68.88,48.75 70.5,50.38 70.5,93.94 69.69,94.75 65.57,94.75 64.82,95.5 | SJ4.1 64.82,95.5 | J1.6 69.29,102.46 68.88,102.88 67.38,102.88 67,102.5 67,101.56 64.82,99.38 64.82,95.5
AUTORST_EN  (via drill 0.25)
  Top 0.152: SJ1.2 62,101.75 62,105.12 63.91,107.04 J1.1 65.96,107.54 68,105.5 v68,104.38 | Q2.3 54.66,32.29 54.33,32.73 53.92,34.17 56,36.25 56,39.5 60.25,43.75 67.75,43.75 69.5,45.5 69.5,48.5 71.25,50.25 71.25,99 v68,102.25
  Bottom 0.152: v68,102.25 v68,104.38
CH343_3V
  Top 0.406: IC1.15 42.53,22.2 42.53,23.29 42.93,23.68 43.25,24.12 C5.1 42.12,24.75 39.75,22.38 39.75,16.62 42.64,13.73 44.63,13.73 C6.1 44.88,14.5 46.11,15.89 IC1.4
DTR
  Top 0.2: IC1.10 48.79,23.3 48.79,24.29 49.3,24.8 52.75,24.8 | R4.1 53.98,24.8 52.75,24.8 | 52.75,24.8 52.8,24.85 Q1.2
EN  (via drill 0.25)
  Top 0.152: IC3.7 41,102.94 R7.2 39.2,104.07 v39.12,104 | SJ1.1 58.75,100 55.88,97.12 55.88,95.62 54.75,94.5 v38.38,94.5 v20.25,94.5 | MOD1.EN 20.2,106.3 v20.25,106.25
  Bottom 0.152: v39.12,104 37.5,102.38 37.5,95.38 v38.38,94.5 | v20.25,106.25 v20.25,94.5
GND  (via drill 0.25, 1 pad 3)
  Top 0.254: IC3.33 41.71,100.29 v41.71,100.31
  other vias: 44.35,103.5 42.65,103.5 42.5,111.25 44.5,111.25 40.75,111.25 36.5,110.75 35.38,112.25 39,111.25 33,112.38 30.5,112.38 28,112.38 25.5,112.38 23,112.38 20.5,112.38 18,112.38 15,112.38 12.25,112.38 9.5,112.38 5.5,112.38 0.75,112.38 3,112.38 46.62,111.25 48.62,111.25 50.75,111.25 54.5,111.25 57.88,111.25 61.75,111.25 63.25,111.25 65.5,111.25 69.5,111.25 74.25,111.25 71.75,111.25 42.65,104.25 42.65,105.19 44.35,105.12 44.35,104.25 42.65,106.62 42.77,107.62 42.71,108.69 44.16,106 44.23,107.06 44.23,108.12 44.29,109.19 44.35,110.38 42.65,110.38 46.04,99 67.5,57.5 67.5,72.5 41.71,101.38 42.84,100.31 42.84,99.19 42.84,98.12 42.84,101.38 50.16,97.19 57.23,95.38 35.65,100.94 37.02,102.88 58.35,97.62 64.04,96.56 70.41,95.06 72.16,100.44 39.38,109.88 41.12,110.12 39.38,108.62 41.75,108.25 40.75,108.88 38.88,106.5 40.75,105.75 45.25,106.75 46.25,107.25 45.75,108.75 46.25,110.25 47.75,110.25 47.25,108.75 47.75,106.75 48.25,104.75 37.5,109.5 36.25,108.25 37,106.62 25.75,104.75 23.25,104.75 24.5,106.25 24.5,103.38 24.5,104.75 55.73,94.75 58.73,99.12 58.85,96.12 58.35,94.38 40.12,107.38 65.72,106.25
  pour Top (isolate 0.153, rank 6): 0,0 75,0 75,111.5 38.25,111.5 37,112.75 0,112.75
  pour Bottom (isolate 0.152, rank 6): 0,0 75,0 75,111.5 38.25,111.5 37,112.75 0,112.75
IO0  (via drill 0.25)  (1 unrouted)
  Top 0.152: IC3.15 39,98.5 | 39,98.5 38.62,98.5 38.5,98.62 R8.2 | SW3.P$2 32.43,25.43 38.5,31.5 38.5,35.38 37.75,36.12 37.75,43.38 34.75,46.38 5.62,46.38 1.5,50.5 1.5,85.5 7.5,91.5 v30.75,91.5 v39.62,91.5 40.5,92.38 57.12,92.38 59.75,95 SJ4.2 | 39,98.5 v39,98 | MOD1.IO0 32.85,102.25 v30.75,102.25
  Bottom 0.152: v39,98 39,96.88 39.62,96.25 v39.62,91.5 | v30.75,102.25 v30.75,91.5
IO1_TX  (via drill 0.25)
  Top 0.152: SJ2.1 58.12,98.5 56.5,96.88 56.5,94.88 55.5,93.88 v45.62,93.88 45.5,93.75 v27.38,93.75 | IC3.26 45.12,98.5 45.62,98 v45.62,97.75 | v29.25,110.25 29.3,110.3 MOD1.TXD/IO1
  Bottom 0.152: v45.62,97.75 v45.62,93.88 | v29.25,110.25 28.62,110.25 27.38,109 v27.38,93.75
IO2  (via drill 0.25)  (1 unrouted)
  Top 0.152: IC3.14 38.68,99 R9.2 37.43,100.25 v35.75,100.25 32.95,100.25 MOD1.IO2 | SW4.P$2 36.95,34.48 36.95,43.3 34.5,45.75 5.25,45.75 0.75,50.25 0.75,85.88 7.12,92.25 v35.75,92.25
  Bottom 0.152: v35.75,100.25 v35.75,92.25
IO3_RX  (via drill 0.25)
  Top 0.152: IC3.25 v44.75,97.25 | MOD1.RXD/IO3 28.55,108.3 v28.5,108.25 | v28.5,93 v44.75,93 56.12,93 58.25,95.12 58.25,96.5 58.75,97 SJ3.1
  Bottom 0.152: v44.75,97.25 v44.75,93 | v28.5,108.25 v28.5,93
IO4  (via drill 0.25)  (1 unrouted)
  Top 0.152: SW2.P$2 28.48,15.48 32.5,19.5 32.5,23.5 41.5,32.5 41.5,38 38.5,41 38.5,43.5 35,47 6,47 2.25,50.75 2.25,85.25 7.62,90.62 v30,90.62 v40.38,90.62 | v39.88,97.5 39.88,97.88 IC3.16 | MOD1.IO4 30.05,104.3 v30,104.25
  Bottom 0.152: v40.38,90.62 40.38,97 v39.88,97.5 | v30,104.25 v30,90.62
IO5  (via drill 0.25, 1 pad 3)  (1 unrouted)
  Top 0.152: SW1.P$2 33.5,16 33.5,22.5 43,32 43,38 39.25,41.75 39.25,43.62 35.25,47.62 6.38,47.62 3,51 3,84.75 v3.75,85.5 8,89.75 v29.25,89.75 v44,89.75 | IC3.24 v44,96.25 | MOD1.IO5 29.3,106.3 v29.25,106.25 28.5,106.25 23.25,111.5 15,111.5 13.45,109.95 LED1.4-DIN
  Bottom 0.152: v3.75,85.5 3.62,85.38 3.62,66.38 v7.5,62.5 | v44,96.25 v44,89.75 | v29.25,106.25 v29.25,89.75
IO12  (via drill 0.25, 1 pad 3)  (1 unrouted)
  Top 0.152: IC3.10 39.25,101 39,101.25 v39,102.12 | SW5.P$2 44.68,42.22 41.56,42.22 35.53,48.25 6.75,48.25 3.75,51.25 3.75,84.25 v4.5,85 8.38,88.88 v18.75,88.88 v41.12,88.88 | CON2.4 6.25,103.5 8,101.75 14.25,101.75 15.7,100.3 MOD1.IO12 18.7,100.3 v18.75,100.25
  Bottom 0.152: v4.5,85 4.38,84.88 4.38,75.62 v7.5,72.5 | v39,102.12 39,101.25 41.12,99.12 v41.12,88.88 | v18.75,100.25 v18.75,88.88
IO13  (via drill 0.25)
  Top 0.152: IC3.12 v38.98,100 | R1.2 50.55,95.38 v38.75,95.38 20.38,95.38 17.45,98.3 MOD1.IO13
  Bottom 0.152: v38.98,100 38.23,99.25 38.23,95.9 v38.75,95.38
IO14  (via drill 0.25, 1 pad 3)  (1 unrouted)
  Top 0.152: IC3.9 39.88,101.5 v39.88,102.12 | SW6.P$2 54.06,47 38,47 36.12,48.88 7.12,48.88 4.5,51.5 4.5,83.62 v5.12,84.25 8.88,88 v19.5,88 v41.88,88 | CON2.3 5.75,104.5 8.2,102.05 16.85,102.05 MOD1.IO14 19.45,102.3 v19.5,102.25
  Bottom 0.152: v5.12,84.25 5.12,79.88 v7.5,77.5 | v39.88,102.12 39.88,101.25 41.88,99.25 v41.88,88 | v19.5,102.25 v19.5,88
IO15  (via drill 0.25, 1 pad 3)  (1 unrouted)
  Top 0.152: IC3.13 38.75,99.5 38.48,99.77 38.48,100.33 R10.2 37.3,101.5 v34.88,101.5 34.62,101.25 31.75,101.25 31.5,101 31.5,99.25 32.45,98.3 MOD1.IO15 | SW7.P$1 61.25,46.75 60.5,46 57.75,46 55.75,48 38,48 36.5,49.5 7.5,49.5 5.25,51.75 5.25,57.5 | 5.25,57.5 5.25,83.25 9.25,87.25 v33.88,87.25 | v7.5,57.5 5.25,57.5
  Bottom 0.152: v34.88,101.5 34.88,88.25 v33.88,87.25
N$3
  pour Top: 58.75,31.75 58.75,28.75 62.75,28.75 62.75,31.75
N$5
  Top 0.2: R5.1 50.99,26.64 Q1.1
N$6
  Top 0.152: R6.1 45.62,102.06 45.62,101.25 45.38,101 IC3.31
N$10
  pour Top: 58.75,19.75 58.75,16.75 62.75,16.75 62.75,19.75
N$12
  Top 0.152: Q3.3 56.25,100 57.19,100.94 D1.2 57.52,100.94 59.79,103.2 P1.-
N$13
  Top 0.2: Q2.1 55.88,32.32 55.88,26.75 54.7,25.58 R4.2
N$16
  Top 0.152: CON1.CC1 45.75,9.05 R3.2
N$17
  Top 0.152: CON1.CC2 48.75,10.95 49.09,11.29 R2.2
N$23
  Top 0.152: R1.1 Q3.1
PC_RX
  Top 0.152: IC1.3 44.86,18.11 47.25,20.5 56.25,20.5 58,22.25 58,35.88 58.5,36.38 63.25,36.38 70.88,44 70.88,47.88 72.88,49.88 72.88,101 73.13,101.25 73.13,103.12 72.38,103.88 67.12,103.88 66.06,104.94 64.91,104.94 | SJ2.2 62.75,101 62.75,103.88 63.82,104.94 64.91,104.94 | 64.91,104.94 J1.3
PC_TX
  Top 0.152: IC1.2 43.61,17.86 46.88,21.12 56,21.12 57.38,22.5 57.38,36.25 58.12,37 63,37 70.25,44.25 70.25,48.12 72.12,50 72.12,99.38 71.62,99.88 71.62,100.69 72.5,101.56 72.5,102.88 72.12,103.25 66.75,103.25 65.96,102.46 J1.5 64.92,101.67 SJ3.2
RST_C
  Top 0.152: IC3.32 44.75,102.25 46.57,104.07 C20.2 R11.1
RTS
  Top 0.2: IC1.11 47.54,23.08 47.54,24.46 47.07,24.93 47.07,26.42 | 47.07,26.42 R5.2 | Q2.2 51.43,32.8 47.07,28.44 47.07,26.42
USB_N
  Top 0.152: IC1.6 48.61,16.86 48.28,16.53 48.28,14.03 47.14,12.89 47.14,8.89 47.25,8.79 CON1.DN1 47.25,6.88 47.12,6.75 46.38,6.75 46.25,6.88 CON1.DN2
USB_P  (via drill 0.25)
  Top 0.152: CON1.DP1 46.75,8.79 46.86,8.89 46.86,9 | 46.86,9 46.86,13.01 48,14.14 48,16.5 47.36,17.14 IC1.5 | CON1.DP2 47.75,9 v47.78,9 | v46.63,9 46.86,9
  Bottom 0.152: v47.78,9 46.66,9.03 v46.63,9
VCC  (via drill 0.25, 1 pad 3)  (1 unrouted)
  Top 0.152: 74,62.5 v73.62,62.5 | 74,77.5 v73.62,77.5 | IC3.17 40.5,97 38.43,97 C17.2 37.05,96.62 v36.62,96.62 | C13.2 40.93,104.07 v40.62,104.38 40.07,104.93 R7.1 | R9.1 37.07,99.12 | 37.07,99.12 R8.1 | 37.07,99.12 v36.5,99.12 | R11.2 47.43,105.69 47.25,105.88 46.12,105.88 45.9,105.65 v45.9,104.25 | 52.62,103.12 53,103.12 53.75,102.38 53.75,100.96 D1.1
  Top 0.254: IC3.30 45.62,100.5 | 45.62,100.5 46.02,100.9 46.02,101.7 46.2,101.88 C14.2 C15.2 46.57,100.31 46.88,100 48.25,100 48.81,100.56 48.81,100.69 48.92,100.8 49.25,100.8 | IC3.29 45.5,100 45.62,100.12 45.62,100.5 | IC3.1 44.04,102.25 45.25,103.46 C12.2 45.72,104.07 v45.9,104.25 | IC3.11 39.12,100.5 38.62,101 38.62,101.38 37.93,102.07 C16.2 37.93,102.94 v37.44,103.44 | IC3.4 42.5,102.75 42.38,102.88 | C13.2 41.25,104 42.38,102.88 | IC3.3 43,102.62 42.75,102.88 42.38,102.88 | v49.62,101.62 49.44,101.44 49.44,100.92 49.56,100.8 | C18.1 12.12,96.17 12.12,96.88 v12.25,97 | 16.98,96.18 MOD1.VCC 17,96.19 C19.1 14.36,96.17 C18.1 | C18.1 11.88,96.3 11.88,96.88 v11.75,97 | C18.1 10.07,94.25 6,94.25 3.12,97.12 3.12,105 3.62,105.5 CON2.2 7,105.5 8.15,106.65 LED1.1-VDD | 49.25,100.8 C10.1 | v49.12,101.62 49.25,101.5 49.25,100.8 | SW7.P$4 74,42.25
  Top 0.508: IC2.4 IC2.2 58.42,9.19 58.42,12.12 C2.1 58.3,13.7 56.7,15.3 C3.1 56.95,15.87 63.37,15.87 63.75,16.25 63.75,33.5 65,34.75 69.75,34.75 74,39 74,42.25 74,62.5 74,77.5 74,106.25 72.71,107.54 J1.2 69.08,107.54 67.75,108.88 62.75,108.88 60.62,106.75 56.25,106.75 P1.+ 52.62,103.12 50.3,100.8 49.56,100.8 C10.1
  Bottom 0.254: v67.5,77.5 v73.62,77.5 | v67.5,62.5 v73.62,62.5 | v36.62,96.62 36.5,96.75 v36.5,99.12 36.5,103.5 36.94,103.94 | 36.94,103.94 38,105 | 38,105 40,105 v40.62,104.38 40.62,103.25 41.75,102.12 45.9,102.12 | 45.9,102.12 48.62,102.12 v49.12,101.62 v49.62,101.62 | 45.9,102.12 v45.9,104.25 | 38,105 38,107.62 34.25,111.38 22,111.38 12.25,101.62 v12.25,97 v11.75,97 | v37.44,103.44 36.94,103.94
VUSB  (via drill 0.25)
  Top 0.406: IC1.16 41.5,21.76 41.5,20.5 v42.88,19.12 | v47.25,19.12 49.12,19.12 49.86,18.39 IC1.7 49.99,17.68 49.99,16.76 50.77,15.98 51.07,15.98 C4.1 51.78,11.53 51.78,11.5
  Top 0.508: 51.78,11.5 51.75,11.5 49.45,9.2 CON1.VBUS@2 49.45,6.83 48.75,6.12 45.27,6.12 44.55,6.85 CON1.VBUS@1 | IC2.3 54.9,9.12 C1.1 52.58,11.44 51.78,11.53
  Bottom 0.406: v42.88,19.12 v47.25,19.12
XTAL_IN
  Top 0.152: IC3.28 44.77,99.53 47.4,99.53 XT1.1 48.12,98.81 C7.2
XTAL_OUT
  Top 0.152: IC3.27 45.2,99 46.52,97.67 XT1.3 46.7,97.63 C11.2

### Text on the board
tPlace: ESP / PROG | 3V3 | EN | MCU | TX | GND | MCU | RX | BOOT | cut to / isolate | ESP8285H16 | Open Source Hardware Camp 2023 | OSHW under the Solderpad Hardware License 2.0 | Project files: lab.electrolama.com/ob23 | Electrolama x oomlout
Reference: CPWG 50 Ohm Params: / H=1.2mm, Er=4.6 (FR-4 standard) / W=0.92mm, G=0.1524mm / Calculated Z=50.0773 Ohms